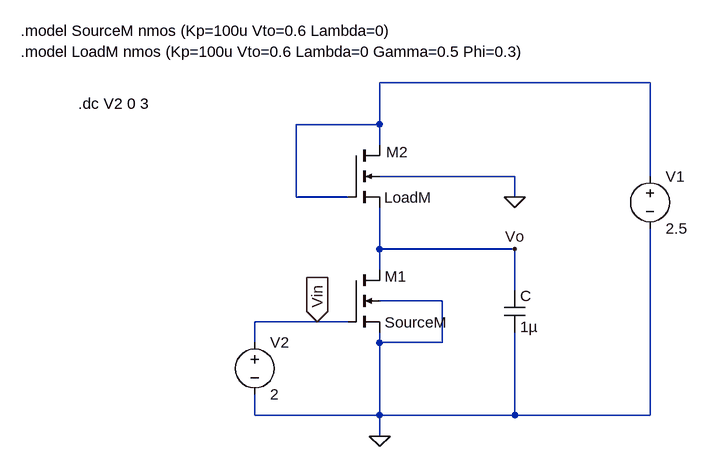
[diagram p0: schematic NMOS_saturated_load_inverter.asc]
NMOS_saturated_load_inverter.asc, the LTspice schematic file:
Version 4
SHEET 1 880 680
WIRE 272 -560 -144 -560
WIRE -144 -496 -144 -560
WIRE -144 -496 -272 -496
WIRE -144 -464 -144 -496
WIRE 64 -416 -144 -416
WIRE 272 -416 272 -560
WIRE -272 -384 -272 -496
WIRE -192 -384 -272 -384
WIRE 64 -384 64 -416
WIRE -144 -304 -144 -368
WIRE 64 -304 -144 -304
WIRE -144 -272 -144 -304
WIRE 64 -240 64 -304
WIRE -48 -224 -144 -224
WIRE -240 -192 -336 -192
WIRE -192 -192 -240 -192
WIRE -336 -160 -336 -192
WIRE -144 -160 -144 -176
WIRE -48 -160 -48 -224
WIRE -48 -160 -144 -160
WIRE -336 -48 -336 -80
WIRE -144 -48 -144 -160
WIRE -144 -48 -336 -48
WIRE 64 -48 64 -176
WIRE 64 -48 -144 -48
WIRE 272 -48 272 -336
WIRE 272 -48 64 -48
WIRE -144 -16 -144 -48
FLAG 64 -384 0
FLAG 64 -304 Vo
FLAG -144 -16 0
FLAG -240 -192 Vin
IOPIN -240 -192 In
SYMBOL nmos4 -192 -272 R0
WINDOW 0 56 10 Left 2
WINDOW 3 56 81 Left 2
SYMATTR InstName M1
SYMATTR Value SourceM
SYMATTR Value2 l=100u w=471u
SYMBOL nmos4 -192 -464 R0
WINDOW 0 58 11 Left 2
WINDOW 3 55 81 Left 2
SYMATTR InstName M2
SYMATTR Value LoadM
SYMATTR Value2 l=168u w=100u
SYMBOL cap 48 -240 R0
SYMATTR InstName C
SYMATTR Value 1µ
SYMBOL voltage -336 -176 R0
WINDOW 123 0 0 Left 0
WINDOW 39 0 0 Left 0
SYMATTR InstName V2
SYMATTR Value 2
SYMBOL voltage 272 -432 R0
SYMATTR InstName V1
SYMATTR Value 2.5
TEXT -696 -640 Left 2 !.model SourceM nmos (Kp=100u Vto=0.6 Lambda=0)
TEXT -696 -608 Left 2 !.model LoadM nmos (Kp=100u Vto=0.6 Lambda=0 Gamma=0.5 Phi=0.3)
TEXT -608 -528 Left 2 !.dc V2 0 3

The netlist it stands for:
* NMOS_saturated_load_inverter.asc
M1 Vo Vin 0 0 SourceM l=100u w=471u
M2 N001 N001 Vo 0 LoadM l=168u w=100u
C Vo 0 1µ
V2 Vin 0 2
V1 N001 0 2.5
.model NMOS NMOS
.model PMOS PMOS
.lib standard.mos
.model SourceM nmos (Kp=100u Vto=0.6 Lambda=0)
.model LoadM nmos (Kp=100u Vto=0.6 Lambda=0 Gamma=0.5 Phi=0.3)
.dc V2 0 3
.backanno
.end